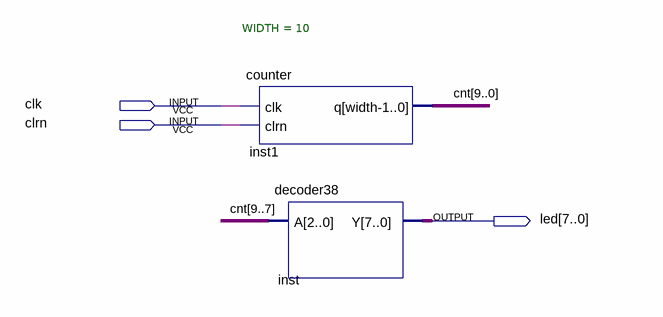
[diagram p0: schematic sheet]
// Quartus schematic fpga_leds.bdf as structural Verilog: 2 symbols, 3 pins
module fpga_leds (
  input  clk,
  input  clrn,
  output [7:0] led
);

  wire [9:0] cnt;

  counter #(.WIDTH(10)) inst1 (.clk(clk), .clrn(clrn), .q(cnt));
  decoder38 inst (.A(cnt[9:7]), .Y(led));
endmodule
